# EAGLE design Qwiic GPS-RTK - ublox NEO-M8P (EAGLE 9.1.1)
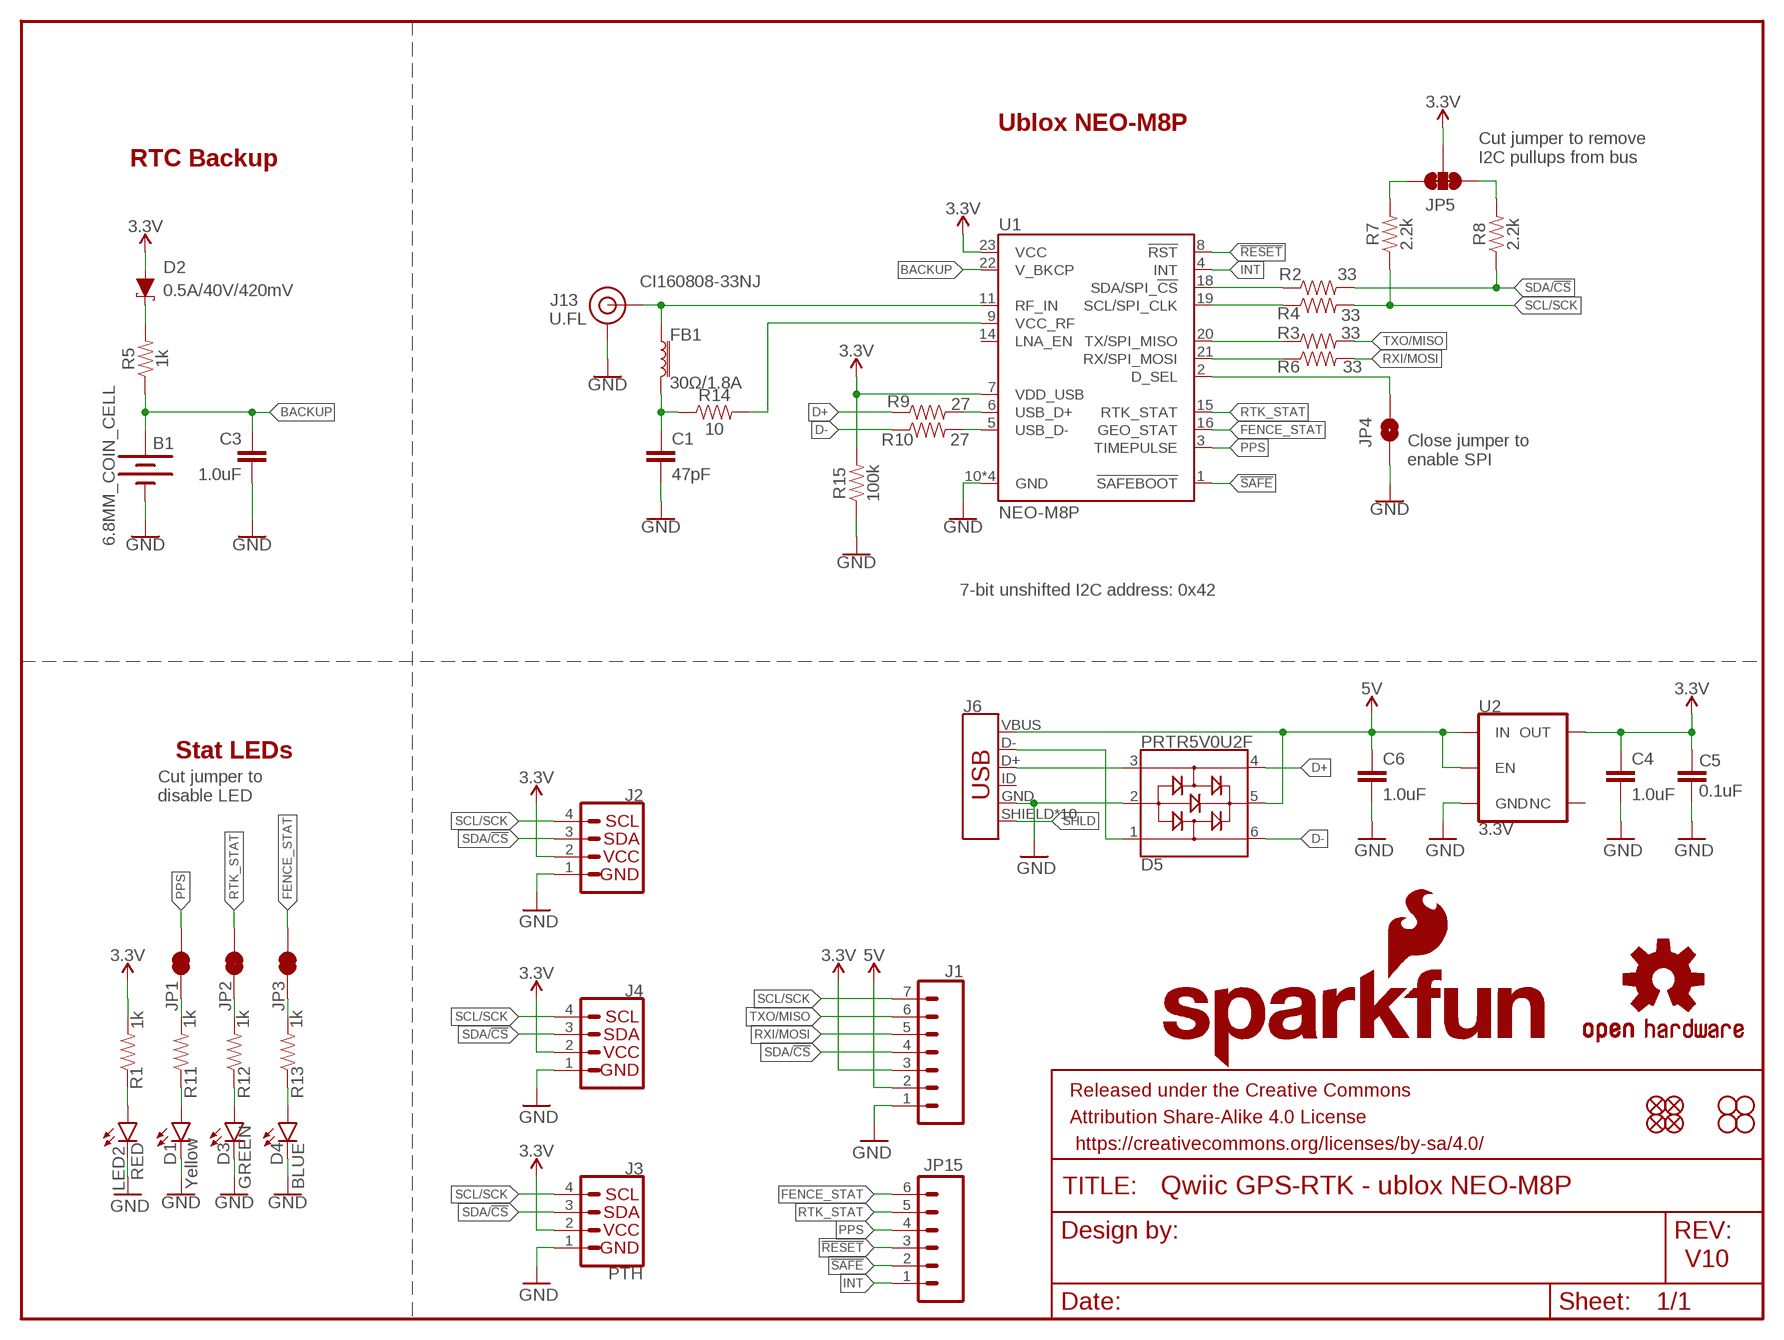
[diagram p0: schematic, sheet 1]

## Parts
B1  6.8MM_COIN_CELL  BATTERY-6.8MM_SMD  [BATTCON-6.8MM]
C1  47pF  47PF-0603-50V-5%  [0603]
C3  1.0uF  1.0UF-0603-16V-10%  [0603]
C4  1.0uF  1.0UF-0603-16V-10%  [0603]
C5  0.1uF  0.1UF-0603-25V-(+80/-20%)  [0603]
C6  1.0uF  1.0UF-0603-16V-10%  [0603]
D1  Yellow  LED-YELLOW0603  [LED-0603]
D2  0.5A/40V/420mV  DIODE-SCHOTTKY-PMEG4005EJ  [SOD-323]
D3  GREEN  LED-GREEN0603  [LED-0603]
D4  BLUE  LED-BLUE0603  [LED-0603]
D5  PRTR5V0U2F  [SOT886]
FB1  30Ω/1.8A  FERRITE_BEAD-0603  [0603]
FRAME1  FRAME-LETTER  [CREATIVE_COMMONS]
J1  CONN_07NO_SILK  [1X07_NO_SILK]
J2  I2C_STANDARDQWIIC  [1X04_1MM_RA]
J3  PTH  I2C_STANDARD_NO_SILK  [1X04_NO_SILK]
J4  I2C_STANDARDQWIIC  [1X04_1MM_RA]
J6  USB_MICRO-B_HALF_PTH_MILL  [USB-MICROB-PTH-MILL]
J13  U.FL  U.FL2PIN  [U.FL]
JP1  JUMPER-SMT_2_NC_TRACE_SILK  [SMT-JUMPER_2_NC_TRACE_SILK]
JP2  JUMPER-SMT_2_NC_TRACE_SILK  [SMT-JUMPER_2_NC_TRACE_SILK]
JP3  JUMPER-SMT_2_NC_TRACE_SILK  [SMT-JUMPER_2_NC_TRACE_SILK]
JP4  JUMPER-SMT_2_NO_SILK  [SMT-JUMPER_2_NO_SILK]
JP5  JUMPER-SMT_3_2-NC_TRACE_SILK  [SMT-JUMPER_3_2-NC_TRACE_SILK]
JP15  M06NO_SILK_FEMALE_PTH  [1X06_NO_SILK]
JP21  FIDUCIALUFIDUCIAL  [MICRO-FIDUCIAL]
JP31  STAND-OFF  [STAND-OFF]
JP41  STAND-OFF  [STAND-OFF]
JP61  FIDUCIALUFIDUCIAL  [MICRO-FIDUCIAL]
JP71  FIDUCIALUFIDUCIAL  [MICRO-FIDUCIAL]
JP81  FIDUCIALUFIDUCIAL  [MICRO-FIDUCIAL]
JP91  STAND-OFF  [STAND-OFF]
JP101  STAND-OFF  [STAND-OFF]
LED2  RED  LED-RED0603  [LED-0603]
LOGO1  OSHW-LOGOMINI  [OSHW-LOGO-MINI]
LOGO2  SFE_LOGO_NAME_FLAME.1_INCH  [SFE_LOGO_NAME_FLAME_.1]
R1  1k  1KOHM-0603-1/10W-1%  [0603]
R2  33  33OHM-0603-1/10W-1%  [0603]
R3  33  33OHM-0603-1/10W-1%  [0603]
R4  33  33OHM-0603-1/10W-1%  [0603]
R5  1k  1KOHM-0603-1/10W-1%  [0603]
R6  33  33OHM-0603-1/10W-1%  [0603]
R7  2.2k  2.2KOHM-0603-1/10W-1%  [0603]
R8  2.2k  2.2KOHM-0603-1/10W-1%  [0603]
R9  27  27OHM-0603-1/10W-1%  [0603]
R10  27  27OHM-0603-1/10W-1%  [0603]
R11  1k  1KOHM-0603-1/10W-1%  [0603]
R12  1k  1KOHM-0603-1/10W-1%  [0603]
R13  1k  1KOHM-0603-1/10W-1%  [0603]
R14  10  10OHM-0603-1/10W-1%  [0603]
R15  100k  100KOHM-0603-1/10W-1%  [0603]
U1  NEO-M8P  NEO-M8PM8P  [NEO-M8P]
U2  3.3V  V_REG_AP2112K-3.3V  [SOT23-5]

## Nets
3.3V [3.3V]: C4.1 C5.2 D2.A J1.3 J2.2 J3.2(VCC) J4.2 JP5.2 R1.2 R15.2 U1.7(VDD_USB) U1.23(VCC) U2.5(OUT)
5V: C6.1 D5.5 J1.2 J6.VBUS U2.1(IN) U2.3(EN)
!RESET: JP15.3 U1.8(!RST)
!SAFE: JP15.2 U1.1(!SAFEBOOT!)
ANT_VCC: C1.1 FB1.2 R14.1
BACKUP: B1.+ C3.1 R5.1 U1.22(V_BKCP)
D+: D5.4 R9.1
D-: D5.6 R10.1
D_SEL: JP4.2 U1.2(D_SEL)
FENCE_STAT: JP3.2 JP15.6 U1.16(GEO_STAT)
GND: B1.- C1.2 C3.2 C4.2 C5.1 C6.2 D1.C D3.C D4.C D5.2 J1.1 J2.1 J3.1(GND) J4.1 J6.GND J13.1(GND) J13.2(GND) JP4.1 LED2.C R15.1 U1.10(GND) U1.12(GND) U1.13(GND) U1.24(GND) U2.2(GND)
GPS_ANT1: FB1.1 J13.FEED(SIGNAL) U1.11(RF_IN)
INT: JP15.1 U1.4(INT)
N$1: D3.A R12.1
N$2: D1.A R11.1
N$3: JP2.1 R12.2
N$4: JP1.1 R11.2
N$5: JP5.1 R8.2
N$6: D2.C R5.2
N$7: D4.A R13.1
N$8: JP5.3 R7.2
N$9: JP3.1 R13.2
N$10: LED2.A R1.1
N$11: R9.2 U1.6(USB_D+)
N$12: R10.2 U1.5(USB_D-)
N$13: R14.2 U1.9(VCC_RF)
PPS: JP1.2 JP15.4 U1.3(TIMEPULSE)
RTK_STAT: JP2.2 JP15.5 U1.15(RTK_STAT)
RXI/MOSI: J1.5 R6.2
RXLV: R6.1 U1.21(RX/SPI_MOSI)
SCL/SCK: J1.7 J2.4 J3.4(SCL) J4.4 R4.2 R7.1
SCL_LV: R4.1 U1.19(SCL/SPI_CLK)
SDA/!CS: J1.4 J2.3 J3.3(SDA) J4.3 R2.2 R8.1
SDA_LV: R2.1 U1.18(SDA/SPI_!CS!)
SHLD: J6.SHIELD J6.SHIELD2(SHIELD) J6.SHIELD3(SHIELD) J6.SHIELD4(SHIELD) J6.SHIELD5(SHIELD) J6.SHIELD6(SHIELD) J6.SHIELD7(SHIELD) J6.SHIELD8(SHIELD) J6.SHIELD9(SHIELD) J6.SHIELD10(SHIELD)
TXLV: R3.1 U1.20(TX/SPI_MISO)
TXO/MISO: J1.6 R3.2
USB_D+: D5.3 J6.D+
USB_D-: D5.1 J6.D-
Unconnected: J6.ID U1.14(LNA_EN) U2.4(NC)

## Notes on the sheet
- Ublox NEO-M8P
- RTC Backup
- Cut jumper to remove 
  I2C pullups from bus
- CI160808-33NJ
- Close jumper to
  enable SPI
- 7-bit unshifted I2C address: 0x42
- Stat LEDs
- Cut jumper to 
  disable LED
- V10

## Library data of the parts
B1 = SparkFun-Batteries:BATTERY: Battery - Single Cell A variety of battery chemistries, sizes, and footprints. Device List: 20MM_PTH - Coin Cell Battery Holder - 20mm (PTH) <https://www.sparkfun.com/products/783> 6.8MM_PTH - Coin Cell Battery Holder - 6.8MM(SMD) <https://www.digikey.com/product-detail/en/seiko-instruments/MS621FE-FL11E/728-1057-ND/1889208?WT.srch=1&gclid=CNOQ5a6LzdQCFZS2wAodXCkE0g> 12MM_SMD - Coin Cell Battery Holder - 12mm (SMD) <https://www.sparkfun.com/products/10592> 12MM_PTH - Coin Cell Battery Holder - 12mm (PTH) <https://www.sparkfun.com/products/7948> 20MM_SMD - 20mm Coin Cell Battery Holder (SMD) (2 legs) Used on the Big Time Watch Kit <https://www.sparkfun.com/products/11734> 20MM_SMD_4LEGS - Coin Cell Battery Holder - 20mm (SMD) <https://www.sparkfun.com/products/11892> 20MM_SMD_4LEGS_OVERPASTE - Coin Cell Battery Holder - 20mm (SMD) <https://www.sparkfun.com/products/11892> (Over-paste on the legs) 24.5MM_PTH - Coin Cell Battery Holder - 24.5mm (PTH) <https://www.sparkfun.com/products/8863> 9V - 9V Battery Holder - PC Mount Used on the SparkFun SparkPunk Sound Kit <https://www.sparkfun.com/products/11177> and SparkFun SparkPunk Sequencer Kit <https://www.sparkfun.com/products/12707> 18650 - Battery Holder - 18650 (PTH) <https://www.sparkfun.com/products/13113> AA - Battery Holder - 1xAA (PTH) <https://www.sparkfun.com/products/7949> AAA - Battery Holder - 1xAAA (PTH) <https://www.sparkfun.com/products/12718> AA_KIT - Battery Holder - 1xAA (PTH) <https://www.sparkfun.com/products/7949> Special kit package - pads only have exposed copper on one side of the board. AAA_KIT - Battery Holder - 1xAAA (PTH) <https://www.sparkfun.com/products/12718> Special kit package - pads only have exposed copper on one side of the board.; PROD_ID: BATT-13734
C1 = SparkFun-Capacitors:47PF: 47pF ceramic capacitors A capacitor is a passive two-terminal electrical component used to store electrical energy temporarily in an electric field.; PROD_ID: CAP-08913
C3 C4 C6 = SparkFun-Capacitors:1.0UF: 1µF ceramic capacitors A capacitor is a passive two-terminal electrical component used to store electrical energy temporarily in an electric field.; PROD_ID: CAP-00868
C5 = SparkFun-Capacitors:0.1UF: 0.1µF ceramic capacitors A capacitor is a passive two-terminal electrical component used to store electrical energy temporarily in an electric field.; PROD_ID: CAP-00810
D1 = SparkFun-LED:LED-YELLOW: Yellow SMD LED Used in manufacturing several products at SparkFun. Packages: 0603 - SMD 0603 package[Product Link] <http://www.kingbrightusa.com/product.asp?catalog_name=LED&product_id=APT1608SYCK> 0603 -SMART - SMART SMD 0603 package (more efficient/more expensive) [Product Link] <http://www.osram-os.com/osram_os/en/products/product-catalog/led-light-emitting-diodes/smartled-0603/ly-l29k/index.jsp> LilyPad - SMD1206 package[Product Datasheet] <https://www.sparkfun.com/datasheets/DevTools/LilyPad/Q150YUS4.pdf> SparkFun Products: Blynk Board <https://www.sparkfun.com/products/13794> IOIO-OTG <https://www.sparkfun.com/products/13613> XBee Explorer Serial <https://www.sparkfun.com/products/13225>; PROD_ID: DIO-09003
D2 = SparkFun-DiscreteSemi:DIODE-SCHOTTKY: Schottky diode A Schottky diode is a semiconductor diode which has a low forward voltage drop and a very fast switching action.; PROD_ID: DIO-10955
D3 = SparkFun-LED:LED-GREEN: Green SMD LED Used in manufacturing of various products at SparkFun Packages: 0603 - SMD 0603 package [Product Link] <http://www.futureelectronics.com/en/technologies/semiconductors/optoelectronics/leds/Pages/9894312-LTST-C190GKT.aspx?CrossPart=HSMG-C190&IM=0> LilyPad 1206 - SMD1206 LilyPad package [Product Link] <http://www.futureelectronics.com/en/Technologies/Product.aspx?ProductID=IN150NGHARVATEKCORPORATION2049943&IM=0> 1206 - SMD1206 package [Product Link] <http://www.futureelectronics.com/en/technologies/semiconductors/optoelectronics/leds/Pages/8315665-LTST-C150KGKT.aspx?IM=0> 1206 Bottom Mount -SMD 1206 Bottom Mount [Product Link] <http://www.digikey.com/product-detail/en/lite-on-inc/LTST-C230KGKT/160-1456-1-ND/386854> SparkFun Products: Pro Mini 328 -5V <https://www.sparkfun.com/products/821> RedBoard <https://www.sparkfun.com/products/12757> MP3 Trigger <https://www.sparkfun.com/products/13720> Makey Makey <https://www.sparkfun.com/products/11076>; PROD_ID: DIO-00821
D4 = SparkFun-LED:LED-BLUE: Blue SMD LED Used in manufacturing of various products at SparkFun Packages: 0603 - SMD 0603 package [Product Link] <http://www.digikey.com/product-detail/en/SMLE12BC7TT86/511-1589-2-ND/1641808> 1206 - SMD1206 package [Product Link] <http://www.digikey.com/product-detail/en/lite-on-inc/LTST-C150TBKT/160-1643-1-ND/573584> SparkFun Products: ESP8266 Thing-Dev Board <https://www.sparkfun.com/products/13711> RedBoard <https://www.sparkfun.com/products/12757>; PROD_ID: DIO-08575
D5 = funbit:PRTR5V0U2
FB1 = SparkFun-Coils:FERRITE_BEAD: Ferrite Bead (blocks, cores, rings, chokes, etc.) Inductor with layers of ferrite used to suppress high frequencies. Often used to isolate high frequency noise. SparkFun Products: IOIO-OTG - V2.2 <https://www.sparkfun.com/products/13613> SparkFun SAMD21 Mini Breakout <https://www.sparkfun.com/products/13664> SparkFun 6 Degrees of Freedom Breakout - LSM6DS3 <https://www.sparkfun.com/products/13339> SparkFun SAMD21 Dev Breakout <https://www.sparkfun.com/products/13672>; PROD_ID: NDUC-13805
FRAME1 = SparkFun-Aesthetics:FRAME-LETTER: Schematic Frame - Letter Standard 8.5x11 US Letter frame
J1 = SparkFun-Connectors:CONN_07: Multi connection point. Often used as Generic Header-pin footprint for 0.1 inch spaced/style header connections On any of the 0.1 inch spaced packages, you can populate with these: Break Away Headers - Straight <https://www.sparkfun.com/products/116> (PRT-00116) Break Away Male Headers - Right Angle <https://www.sparkfun.com/products/553> (PRT-00553) Female Headers <https://www.sparkfun.com/products/115> (PRT-00115) Break Away Headers - Machine Pin <https://www.sparkfun.com/products/117> (PRT-00117) Break Away Female Headers - Swiss Machine Pin <https://www.sparkfun.com/products/743> (PRT-00743) For SCREWTERMINALS and SPRING TERMINALS visit here: Screw Terimnals on SparkFun.com <https://www.sparkfun.com/search/results?term=Screw+Terminals> (5mm/3.5mm/2.54mm spacing) This device is also useful as a general connection point to wire up your design to another part of your project. Our various solder wires solder well into these plated through hole pads. Hook-Up Wire - Assortment (Stranded, 22 AWG) <https://www.sparkfun.com/products/11375> (PRT-11375) Hook-Up Wire - Assortment (Solid Core, 22 AWG) <https://www.sparkfun.com/products/11367> (PRT-11367) View the entire wire category on our website here <https://www.sparkfun.com/categories/141> Special notes: Molex polarized connector foot print use with SKU : PRT-08231 with associated crimp pins and housings. 1MM SMD Version SKU: PRT-10208 NOTES ON THE VARIANTS LOCK and LOCK_LONGPADS... This footprint was designed to help hold the alignment of a through-hole component (i.e. 6-pin header) while soldering it into place. You may notice that each hole has been shifted either up or down by 0.005 of an inch from it's more standard position (which is a perfectly straight line). This slight alteration caused the pins (the squares in the middle) to touch the edges of the holes. Because they are alternating, it causes a "brace" to hold the component in place. 0.005 has proven to be the perfect amount of "off-center" position when using our standard breakaway headers. Although looks a little odd when you look at the bare footprint, once you have a header in there, the alteration is very hard to notice. Also,if you push a header all the way into place, it is covered up entirely on the bottom side.
J2 J4 = SparkFun-Connectors:I2C_STANDARD: SparkFun I2C Standard Pinout Header SparkFun has standardized on a pinout for all I2C based sensor breakouts. This pinout allows I2C boards to be plugged directly into the headers on Arduino Uno compatible boards, and to be daisy chained easily. Example SparkFun Products: SparkFun Atmospheric Sensor Breakout - BME280 <https://www.sparkfun.com/products/13676> SparkFun Altitude/Pressure Sensor Breakout - MPL3115A2 <https://www.sparkfun.com/products/11084> SparkFun TOF Range Finder Sensor - VL6180 <https://www.sparkfun.com/products/12785>; PROD_ID: CONN-13694; VALUE: Qwiic Right Angle
J3 = SparkX:I2C_STANDARD: SparkFun I2C Standard Pinout Header SparkFun has standardized on a pinout for all I2C based sensor breakouts. This pinout allows I2C boards to be plugged directly into the headers on Arduino Uno compatible boards, and to be daisy chained easily. Example SparkFun Products: SparkFun Atmospheric Sensor Breakout - BME280 <https://www.sparkfun.com/products/13676> SparkFun Altitude/Pressure Sensor Breakout - MPL3115A2 <https://www.sparkfun.com/products/11084> SparkFun TOF Range Finder Sensor - VL6180 <https://www.sparkfun.com/products/12785>
J6 = SparkFun-Connectors:USB_MICRO-B: USB Type Micro-B Connector Male/female and PTH/SMT variants SparkFun Products: SparkFun microB USB Breakout <https://www.sparkfun.com/products/12035> SparkFun USB microB Plug Breakout <https://www.sparkfun.com/products/10031> SparkFun ESP8266 Thing <https://www.sparkfun.com/products/13231>; PROD_ID: CONN-13711
J13 = SparkFun-Connectors:U.FL2PIN: SMD Antenna Connector - U.FL 2mm height, 3.0mm x 3.0mm receptacle size. SparkFun Products: SparkFun WiFi Shield - ESP8266 <https://www.sparkfun.com/products/13287> SparkFun ESP8266 Thing <https://www.sparkfun.com/products/13231> SparkFun MiniGen - Pro Mini Signal Generator Shield <https://www.sparkfun.com/products/11420>; PROD_ID: CONN-09193; SF_ID: WRL-09144
JP1-JP3 = SparkFun-Jumpers:JUMPER-SMT_2_NC_TRACE: Normally closed trace jumper This jumper has a trace between two pads so it's normally closed (NC). Use a razor knife to open the connection. For best results follow the IPC guidelines for cutting traces: Cutout at least 0.063 mm (0.005 in). Remove all loose material to clean up the cut area. Seal the cut with an approved epoxy. Reapply solder to reclose the connection.
JP4 = SparkFun-Jumpers:JUMPER-SMT_2_NO: Normally open jumper This jumper has two pads in close proximity to each other. Apply solder to close the connection. Round pads are easier to solder for beginners, but are a lot larger. SparkFun Product that uses the round pads: SparkFun EL Sequencer <https://www.sparkfun.com/products/12781>
JP5 = SparkFun-Jumpers:JUMPER-SMT_3_2-NC_TRACE: Normally closed trace jumper (2 of 2 connections) This jumper has a trace between all three pads so they are normally closed (NC). Use a razor knife to open the connection(s). For best results follow the IPC guidelines for cutting traces: Cutout at least 0.063 mm (0.005 in). Remove all loose material to clean up the cut area. Seal the cut with an approved epoxy. Reapply solder to reclose the connection(s).
JP15 = SparkFun-Connectors:M06: Header 6 Standard 6-pin 0.1" header. Use with straight break away headers (SKU : PRT-00116), right angle break away headers (PRT-00553), swiss pins (PRT-00743), machine pins (PRT-00117), and female headers (PRT-00115). Molex polarized connector foot print use with SKU : PRT-08094 with associated crimp pins and housings. NOTES ON THE VARIANTS LOCK and LOCK_LONGPADS... This footprint was designed to help hold the alignment of a through-hole component (i.e. 6-pin header) while soldering it into place. You may notice that each hole has been shifted either up or down by 0.005 of an inch from it's more standard position (which is a perfectly straight line). This slight alteration caused the pins (the squares in the middle) to touch the edges of the holes. Because they are alternating, it causes a "brace" to hold the component in place. 0.005 has proven to be the perfect amount of "off-center" position when using our standard breakaway headers. Although looks a little odd when you look at the bare footprint, once you have a header in there, the alteration is very hard to notice. Also,if you push a header all the way into place, it is covered up entirely on the bottom side. This idea of altering the position of holes to aid alignment will be further integrated into the Sparkfun Library for other footprints. It can help hold any component with 3 or more connection pins.; PROD_ID: CONN-08437
JP21 JP61 JP71 JP81 = SparkFun:FIDUCIAL: Fiducial Alignment Points Various fiducial points for machine vision alignment.
JP31 JP41 JP91 JP101 = SparkFun:STAND-OFF: Stand Off This is the mechanical footprint for a #4 phillips button head screw. Use the keepout ring to avoid running the screw head into surrounding components. SKU : PRT-00447
LED2 = SparkFun-LED:LED-RED: Red SMD LED Used in manufacturing of most products at SparkFun Packages: 0603 - SMD 0603 package [Product Link] <http://docs.avagotech.com/docs/AV02-0551EN> 0603 SMART - SMD 0603 SMART package ( more efficient and expensive)[Product Link] <http://www.osram-os.com/Graphics/XPic2/00077099_0.pdf> 1206 - SMD1206 package [Product Link] <https://www.sparkfun.com/datasheets/DevTools/LilyPad/Q150OVS4.pdff> SparkFun Products: Pro Mini 328 -5V <https://www.sparkfun.com/products/821> RedBoard <https://www.sparkfun.com/products/12757> IOIO-OTG <https://www.sparkfun.com/products/13613>; PROD_ID: DIO-00819
LOGO1 = SparkFun-Aesthetics:OSHW-LOGO: Open-Source Hardware (OSHW) Logo This logo indicates the piece of hardware it is found on incorporates a OSHW license and/or adheres to the definition of open source hardware found here: http://freedomdefined.org/OSHW
LOGO2 = SparkFun-Aesthetics:SFE_LOGO_NAME_FLAME: SparkFun Font Logo w/ Flame This is the SparkFun full logo. The logo on the schematic will always be the same size; the package variant is the height of the flame part of the logo. Default layer for the logo on the board is tSilk.
R1 R5 R11-R13 = SparkFun-Resistors:1KOHM: 1kΩ resistor A resistor is a passive two-terminal electrical component that implements electrical resistance as a circuit element. Resistors act to reduce current flow, and, at the same time, act to lower voltage levels within circuits. - Wikipedia; PROD_ID: RES-07856
R2-R4 R6 = SparkFun-Resistors:33OHM: 33Ω resistor A resistor is a passive two-terminal electrical component that implements electrical resistance as a circuit element. Resistors act to reduce current flow, and, at the same time, act to lower voltage levels within circuits. - Wikipedia; PROD_ID: RES-08270
R7 R8 = SparkFun-Resistors:2.2KOHM: 2.2kΩ resistor A resistor is a passive two-terminal electrical component that implements electrical resistance as a circuit element. Resistors act to reduce current flow, and, at the same time, act to lower voltage levels within circuits. - Wikipedia; PROD_ID: RES-08272
R9 R10 = SparkFun-Resistors:27OHM: 27Ω resistor A resistor is a passive two-terminal electrical component that implements electrical resistance as a circuit element. Resistors act to reduce current flow, and, at the same time, act to lower voltage levels within circuits. - Wikipedia; PROD_ID: RES-09334
R14 = SparkFun-Resistors:10OHM: 10Ω resistor A resistor is a passive two-terminal electrical component that implements electrical resistance as a circuit element. Resistors act to reduce current flow, and, at the same time, act to lower voltage levels within circuits. - Wikipedia; PROD_ID: RES-12581
R15 = SparkFun-Resistors:100KOHM: 100kΩ resistor A resistor is a passive two-terminal electrical component that implements electrical resistance as a circuit element. Resistors act to reduce current flow, and, at the same time, act to lower voltage levels within circuits. - Wikipedia; PROD_ID: RES-07828
U1 = NEO-M8P:NEO-M8P; PROD_ID: IC-14069
U2 = SparkFun-IC-Power:V_REG_AP2112: AP2112 - 600mA CMOS LDO Regulator w/ Enable The AP2112 is CMOS process low dropout linear regulator with enable function, the regulator delivers a guaranteed 600mA (min.) continuous load current. Features Output Voltage Accuracy: ±1.5% Output Current: 600mA (Min.) Foldback Short Current Protection: 50mA Enable Function to Turn ON/OFF VOUT Low Dropout Voltage (3.3V): 250mV (Typ.) @IOUT=600mA Excellent Load Regulation: 0.2%/A (Typ.) Excellent Line Regulation: 0.02%/V (Typ.) Low Quiescent Current: 55μA (Typ.) Low Standby Current: 0.01μA (Typ.) Low Output Noise: 50μVRMS PSRR: 100Hz -65dB, 1kHz -65dB OTSD Protection Stable with 1.0μF Flexible Cap: Ceramic, Tantalum and Aluminum Electrolytic Operation Temperature Range: -40°C to 85°C ESD: MM 400V, HBM 4000V; PROD_ID: VREG-12457

## Net classes
1 vcc: width 0.152 mm
2 3.3V: width 0.508 mm

## Board
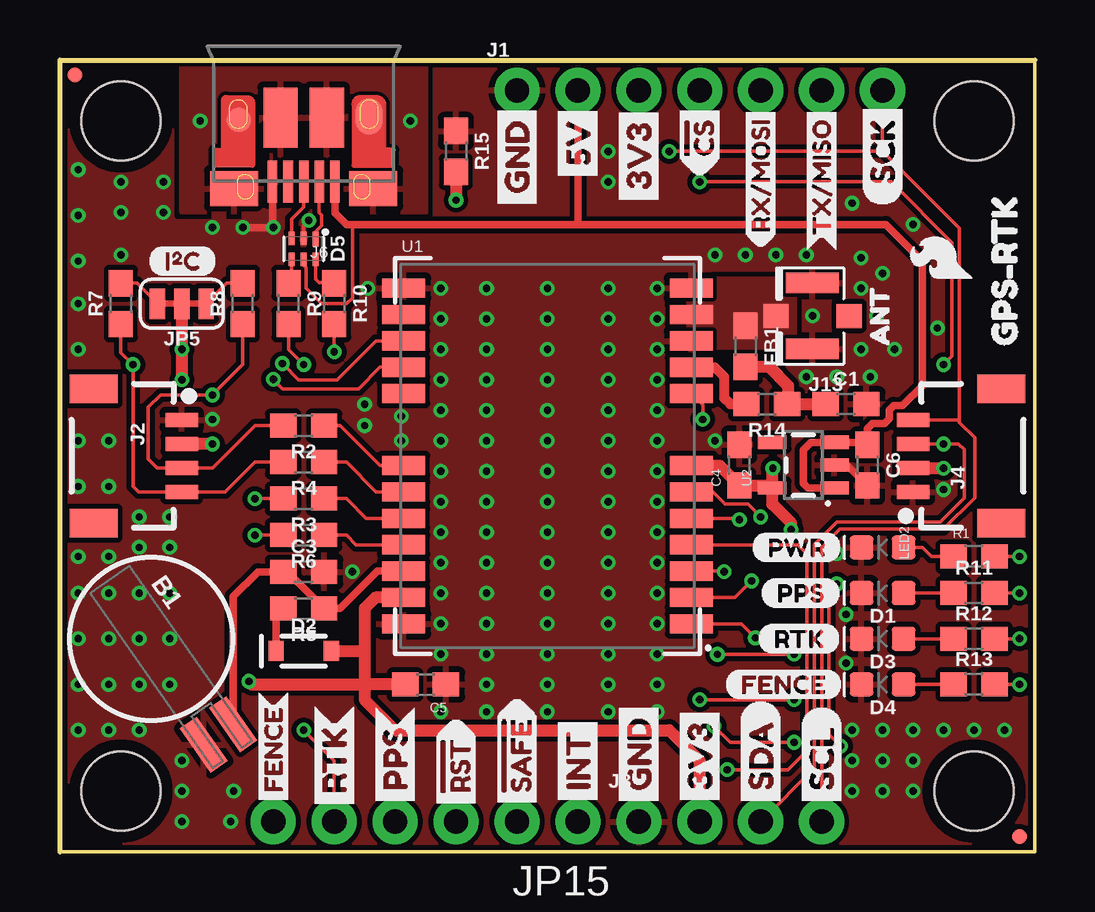
[diagram p1: board, top side]
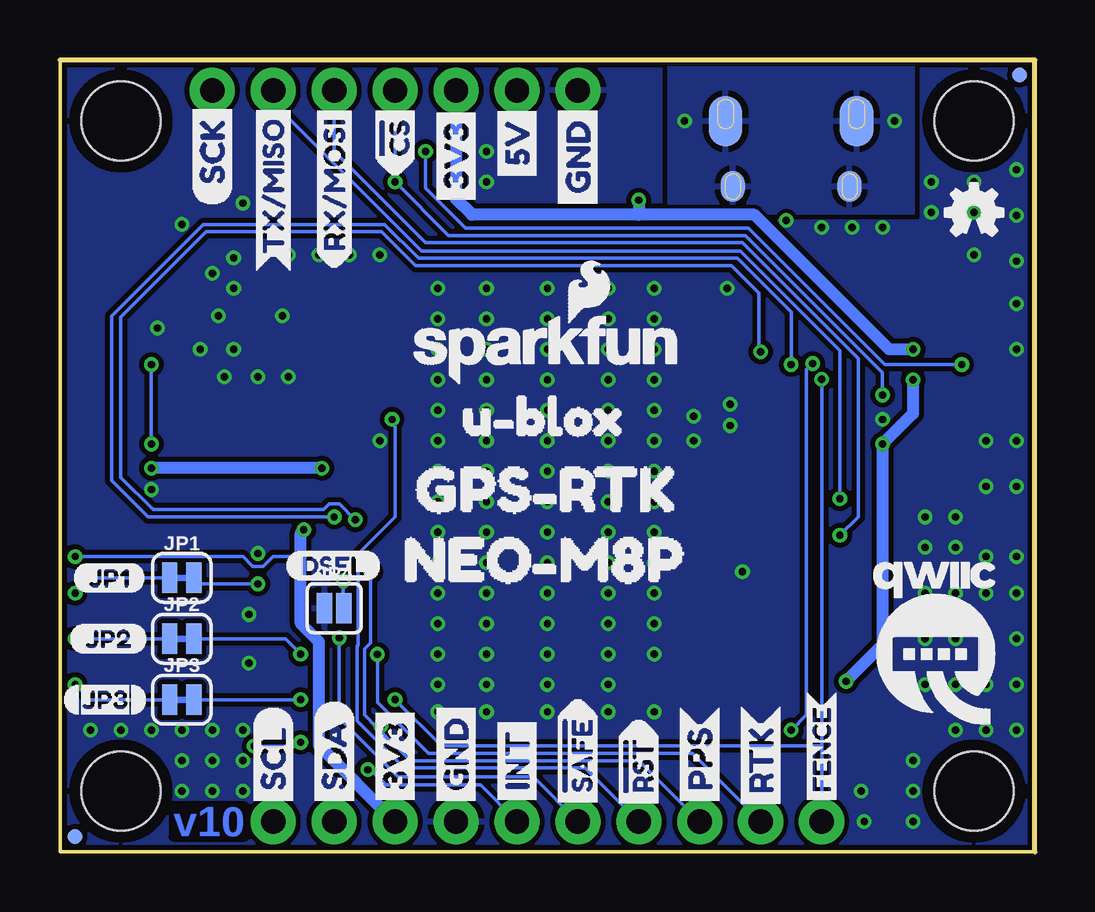
[diagram p2: board, bottom side, seen from below]

Size 40.64 x 33.02 mm. Coordinates in mm from the lower left corner, seen from the top.
Outline: 0,0 0,33.02 40.64,33.02 40.64,0 0,0
Copper layers (1*16): Top 0.035mm / dielectric 1.5mm / Bottom 0.035mm
Design rules "SparkFun-2-layer-PCBWay-LIMIT": minimum track width 6mil, minimum drill 0.3mm, track to track 6mil, track to pad 6mil, pad to pad 6mil, via to via 6mil, smd to smd 6mil, copper to edge 6mil, drill to drill 6mil, minimum pad ring 6mil, minimum via ring 6mil, stop-mask expansion 4mil, vias tented up to drill 25mil, thermal gap 10mil

### Footprints (pad centres in the part's own frame; a part is rotated, then mirrored left to right if it is on the bottom)
BATTCON-6.8MM = smd 2.25 x 0.85: + 4.87,0.75; - 4.87,-0.75
0603 = smd 1.1 x 1: 1 -0.85,0; 2 0.85,0
LED-0603 = smd 1 x 1: A -0.877,0; C 0.877,0
SOD-323 = smd 0.63 x 0.83: A 1.15,0; C -1.15,0
SOT886 = smd 0.61 x 0.25: 1 -0.405,0.5 | smd 0.56 x 0.25: 2 -0.43,0; 3 -0.43,-0.5; 4 0.43,-0.5; 5 0.43,0; 6 0.43,0.5
1X07_NO_SILK = drill 1.016 pad 1.88: 1 0,0; 2 2.54,0; 3 5.08,0; 4 7.62,0; 5 10.16,0; 6 12.7,0; 7 15.24,0
1X04_1MM_RA = smd 0.6 x 1.35: 1 -1.5,0; 2 -0.5,0; 3 0.5,0; 4 1.5,0 | smd 1.2 x 2: NC1 2.8,-3.675; NC2 -2.8,-3.675
1X04_NO_SILK = drill 1.016 pad 1.88: 1 0,0; 2 2.54,0; 3 5.08,0; 4 7.62,0
USB-MICROB-PTH-MILL = smd 0.4 x 1.75: D+ 0,0; D- -0.65,0; GND 1.3,0; ID 0.65,0; VBUS -1.3,0 | smd 2 x 1.46: SHIELD -2.9,0.275; SHIELD2 2.9,0.275 | smd 1.425 x 2.5: SHIELD3 -0.963,-2.675; SHIELD4 0.963,-2.675 | smd 1.4 x 2.1 bottom: SHIELD5 -2.731,-2.531; SHIELD7 2.729,-2.531 | smd 1 x 1: SHIELD6 2.7,-2.575 | smd 1.1 x 1.5: SHIELD8 -2.731,-2.731 | smd 1 x 1.3 bottom: SHIELD9 -2.43,0.195; SHIELD10 2.43,0.195
U.FL = smd 2.2 x 0.85: 1 0,1.375; 2 0,-1.375 | smd 1.05 x 1: FEED 1.525,0; NC -1.525,0
SMT-JUMPER_2_NC_TRACE_SILK = smd 0.635 x 1.27: 1 -0.508,0; 2 0.508,0
SMT-JUMPER_2_NO_SILK = smd 0.635 x 1.27: 1 -0.406,0; 2 0.406,0
SMT-JUMPER_3_2-NC_TRACE_SILK = smd 0.635 x 1.27: 1 -1.016,0; 2 0,0; 3 1.016,0
1X06_NO_SILK = drill 1.016 pad 1.88: 1 0,0; 2 2.54,0; 3 5.08,0; 4 7.62,0; 5 10.16,0; 6 12.7,0
MICRO-FIDUCIAL = smd 0.635 x 0.635: 1 0,0
STAND-OFF = hole 3.302: 0,0
NEO-M8P = smd 1.8 x 0.8: 1 6,-7; 2 6,-5.9; 3 6,-4.8; 4 6,-3.7; 5 6,-2.6; 6 6,-1.5; 7 6,-0.4; 8 6,2.6; 9 6,3.7; 10 6,4.8; 11 6,5.9; 12 6,7; 13 -6,7; 14 -6,5.9; 15 -6,4.8; 16 -6,3.7; 17 -6,2.6; 18 -6,-0.4; 19 -6,-1.5; 20 -6,-2.6; 21 -6,-3.7; 22 -6,-4.8; 23 -6,-5.9; 24 -6,-7
SOT23-5 = smd 0.55 x 1.2: 1 -0.95,-1.3; 2 0,-1.3; 3 0.95,-1.3; 4 0.95,1.3; 5 -0.95,1.3

### Placement (x,y rotation side)
B1  3.81,8.89 305 top
C1  32.77,18.67 0 top
C3  10.16,11.68 0 top
C4  28.32,16.13 90 top
C5  15.24,6.99 180 top
C6  33.66,16.13 270 top
D1  34.29,10.79 180 top
D2  10.16,8.38 0 top
D3  34.29,8.89 180 top
D4  34.29,6.99 180 top
D5  10.16,25.15 270 top
FB1  28.57,21.08 270 top
FRAME1  -17.78,-17.78 0 top  (outside the outline)
J1  19.05,31.75 0 top
J2  5.08,16.51 270 top
J3  24.13,1.27 0 top
J4  35.56,16.51 90 top
J6  10.16,27.94 180 top
J13  31.37,22.35 180 top
JP1  35.56,11.43 0 bottom
JP2  35.56,8.89 0 bottom
JP3  35.56,6.35 0 bottom
JP4  29.21,10.16 0 bottom
JP5  5.08,22.86 180 top
JP15  21.59,1.27 180 top
JP21  40.01,0.64 0 top
JP31  2.54,30.48 0 top
JP41  38.1,30.48 0 top
JP61  0.64,32.38 0 top
JP71  40.01,0.64 0 bottom
JP81  0.64,32.38 0 bottom
JP91  2.54,2.54 0 top
JP101  38.1,2.54 0 top
LED2  34.29,12.7 180 top
LOGO1  2.54,26.67 0 bottom
LOGO2  26.29,19.43 0 bottom
R1  38.1,12.32 0 top
R2  10.16,17.78 180 top
R3  10.16,14.73 180 top
R4  10.16,16.26 180 top
R5  10.16,10.16 180 top
R6  10.16,13.21 180 top
R7  2.54,22.86 90 top
R8  7.62,22.86 90 top
R9  9.53,22.86 270 top
R10  11.43,22.86 270 top
R11  38.1,10.79 0 top
R12  38.1,8.89 0 top
R13  38.1,6.99 0 top
R14  29.46,18.67 180 top
R15  16.51,29.21 270 top
U1  20.32,16.51 0 top
U2  30.99,16.13 90 top
U$1  [SDA-[)]  29.21,1.65 90 top
U$3  [SCL-[)]  31.75,1.65 90 top
U$4  [SDA-[)]  29.21,1.65 90 bottom
U$5  [SCL-[)]  31.75,1.65 90 bottom
U$6  [3V3-04]  26.67,1.65 90 top
U$7  [3V3-04]  26.67,1.65 90 bottom
U$8  [GND-04]  24.13,1.65 90 top
U$9  [GND-04]  24.13,1.65 90 bottom
U$10  [I_SUPER2_C-()-03]  3.68,24.64 0 top
U$11  [FENCE2]  27.69,6.99 0 top
U$12  [JP20]  40.26,8.89 0 bottom
U$13  [RTK1]  29.08,8.89 0 top
U$14  [FENCE0]  8.89,1.78 90 top
U$15  [INT8]  21.59,1.65 90 top
U$16  [INT8]  21.59,1.65 90 bottom
U$17  [FENCE0]  8.89,1.78 90 bottom
U$18  [PWR-()-03]  28.83,12.7 0 top
U$19  [5V]  21.59,27.69 90 top
U$20  [5V]  21.59,27.69 90 bottom
U$21  [GPS#RTK0]  39.37,20.19 90 top
U$22  [U#BLOX3]  25.27,18.16 0 bottom
U$23  [CS#-<]]  26.67,27.94 90 top
U$24  [CS#-<]]  26.67,27.94 90 bottom
U$25  [JP10]  40.13,11.43 0 bottom
U$26  [RX#MOSI2]  29.21,25.15 90 top
U$27  [DSEL0]  31.24,11.94 0 bottom
U$28  [RTK1]  11.43,1.52 90 bottom
U$29  [RTK1]  11.43,1.52 90 top
U$30  [QWIIC-LOGO-MEDIUM]  4.19,8.76 0 bottom
U$31  [RX#MOSI3]  29.21,24.26 90 bottom
U$32  [JP32]  40.51,6.35 0 bottom
U$33  [SFE_LOGO_FLAME_.1]  38.35,23.62 90 top
U$34  [TX#MISO0]  31.75,25.02 90 top
U$35  [#RST3]  16.51,1.4 90 top
U$36  [#RST3]  16.51,1.4 90 bottom
U$37  [TX#MISO1]  31.75,24.13 90 bottom
U$38  [SCK-(]-04]  34.29,26.92 90 top
U$39  [#SAFE1]  19.05,1.4 90 top
U$40  [#SAFE1]  19.05,1.4 90 bottom
U$41  [SCK-(]-04]  34.29,26.92 90 bottom
U$43  [PPS5]  13.97,1.65 90 top
U$44  [PPS5]  13.97,1.65 90 bottom
U$52  [PPS0]  29.21,10.79 0 top
U$53  [NEO#M8P3]  27.94,12.19 0 bottom
U$54  [GPS#RTK1]  27.43,15.11 0 bottom
U$55  [ANT0]  34.16,20.45 90 top
U$60  [3V3-04]  24.13,26.67 90 bottom
U$61  [3V3-04]  24.13,26.67 90 top
U$62  [GND-04]  19.05,26.54 90 bottom
U$63  [GND-04]  19.05,26.54 90 top

### Tracks (layer width: path | path; a pad name or v marks a point on that pad's centre or on a via)
3.3V  (via drill 0.3)
  Top 0.152: v5.08,20.95 JP5.2 | R1.2 v40.01,12.32
  Top 0.508: v6.35,17.01 J2.2 | JP5.2 v5.08,19.68 | U1.7 27.49,16.11 C4.1 29.59,15.28 U2.5 | U2.5 29.69,15.97 v29.72,16 | J4.2 v36.83,16 | v30.48,13.44 30.48,13.72 29.69,14.51 U2.5 | J3.2 26.67,3.81 25.4,5.08 13.97,5.08 12.7,6.35 12.7,6.99 | U1.23 13.15,10.61 12.7,10.16 12.7,8.38 | 12.7,8.38 12.7,6.99 | C5.2 12.7,6.99 | v7.87,7.11 8,6.99 12.7,6.99 | D2.A 12.7,8.38 | R15.2 v16.51,27.18
  Bottom 0.152: v40.01,12.32 33.01,12.32 32.61,11.91 32.16,11.91 31.76,12.32 30.61,12.32
  Bottom 0.508: v5.08,20.95 6.07,20.95 11.69,26.57 16.51,26.57 | v5.08,19.68 5.08,18.28 v6.35,17.01 6.35,8.64 v7.87,7.11 | v29.72,16 v36.83,16 | J3.2 29.84,4.45 29.84,8.76 30.61,9.53 30.61,12.32 30.61,13.31 v30.48,13.44 | J1.3 24.13,27.23 23.47,26.57 16.51,26.57 | v16.51,27.18 16.51,26.57
5V
  Top 0.152: D5.5 10.16,24.45 10.25,24.36 10.25,23.51 10.91,22.86 11.95,22.86 12.19,23.1 12.19,26.16
  Top 0.254: 33.62,17.02 C6.1
  Top 0.305: J6.VBUS 11.46,26.64 11.94,26.16 12.19,26.16 21.59,26.16 | 33.62,17.02 33.66,17.06 33.63,17.08 U2.3 31.3,17.08 30.99,16.76 30.99,15.37 31.18,15.18 U2.1 | 21.59,26.16 34.42,26.16 35.94,24.64 35.94,19.43 35.12,18.61 34.76,18.61 34.58,18.44 34.58,18.07 34.37,17.86 33.87,17.86 33.66,17.65 C6.1 | J1.2 21.59,26.16
!RESET  (via drill 0.3)
  Top 0.152: U1.8 26.8,18.63 v26.8,18.03
  Bottom 0.152: JP15.3 18.75,3.5 26.29,3.5 28.25,5.46 28.25,8.59 28.22,8.61 28.22,12.42 26.67,13.97 26.67,17.91 v26.8,18.03
!SAFE  (via drill 0.3)
  Top 0.152: U1.1 28.41,9.51 v28.99,8.93
  Bottom 0.152: JP15.2 20.9,3.12 26.54,3.12 29.01,5.59 29.01,8.91 v28.99,8.93
ANT_VCC
  Top 0.305: R14.1 30.48,18.67 30.35,18.8
  Top 0.508: 30.48,18.67 C1.1 | FB1.2 29.55,20.23 30.35,19.43 30.35,18.8
BACKUP
  Top 0.152: 9.49,11.68 C3.1
  Top 0.305: U1.22 13.23,11.71 11.68,10.16 R5.1 9.49,11.68 | B1.+ 7.22,10.65 8.26,11.68 C3.1
D+
  Top 0.152: D5.4 9.66,23.84 R9.1
D-
  Top 0.152: D5.6 10.66,23.88 10.79,23.75 11.39,23.75 R10.1
D_SEL  (via drill 0.3)
  Top 0.152: U1.2 28.14,10.61 v28.83,11.3
  Bottom 0.152: v28.83,11.3 28.83,10.19 JP4.2
FENCE_STAT  (via drill 0.3)
  Top 0.152: v30.61,6.35 v26.67,6.35 | U1.16 13.35,20.21 12.45,19.3 9.29,19.3 v8.89,19.7
  Bottom 0.152: JP3.2 v30.61,6.35 | v26.67,6.35 24.74,4.42 8.91,4.42 8.89,4.45 | v8.89,19.7 8.89,4.45 | 8.89,4.45 JP15.6
GND  (via drill 0.3)
  Top 0.152: D5.2 10.16,26.13 v10.37,26.34
  Top 0.305: J6.GND 8.86,26.04 v7.62,26.04 | U2.2 32.8,16.13 C6.2
  other vias: 6.35,18.03 32.77,9.91 32.38,12.45 32.77,7.87 33.02,3.81 15.88,9.53 17.78,9.53 7.24,2.54 12.19,11.68 12.83,23.5 36.83,15.11 34.29,24.13 20.32,9.53 22.86,9.53 24.89,9.53 15.88,10.79 17.78,10.79 20.32,10.79 22.86,10.79 24.89,10.79 15.88,12.06 17.78,12.06 20.32,12.06 22.86,12.06 24.89,12.06 15.88,13.34 17.78,13.34 20.32,13.34 22.86,13.34 24.89,13.34 15.88,14.61 17.78,14.61 20.32,14.61 22.86,14.61 24.89,14.61 15.88,15.88 17.78,15.88 20.32,15.88 22.86,15.88 24.89,15.88 15.88,17.14 17.78,17.14 20.32,17.14 22.86,17.14 24.89,17.14 15.88,18.41 17.78,18.41 20.32,18.41 22.86,18.41 24.89,18.41 15.88,19.68 17.78,19.68 20.32,19.68 22.86,19.68 24.89,19.68 15.88,20.95 17.78,20.95 20.32,20.95 22.86,20.95 24.89,20.95 15.88,22.23 17.78,22.23 20.32,22.23 22.86,22.23 24.89,22.23 15.88,23.5 17.78,23.5 20.32,23.5 22.86,23.5 24.89,23.5 31.11,19.81 33.4,20.95 33.4,23.5 36.58,21.84 33.02,27.05 35.56,26.16 22.86,27.94 22.86,29.21 31.37,22.35 27.3,17.14 33.02,2.54 35.56,2.54 35.56,3.81 38.1,5.08 7.11,1.27 5.08,1.27 5.08,2.54 0.76,24.64 0.76,26.54 0.76,28.45 2.54,27.94 0.76,15.24 0.76,17.14 0.76,20.95 0.76,22.86 0.76,5.08 0.76,6.99 0.76,8.89 0.76,10.79 0.76,12.32 2.03,5.08 2.03,6.99 2.03,8.89 2.03,10.79 2.03,12.32 3.3,5.08 3.3,6.99 3.3,8.89 3.3,10.79 3.3,12.7 5.08,3.81 4.57,6.99 4.57,8.89 4.57,10.79 4.57,12.7 15.88,8.26 17.78,8.26 20.32,8.26 22.86,8.26 24.89,8.26 17.78,6.99 20.32,6.99 22.86,6.99 24.89,6.99 15.88,5.84 17.78,5.84 20.32,5.84 22.86,5.84 24.89,5.84 2.54,24.89 2.54,26.67 4.32,26.67 4.32,27.94 8.89,26.04 6.35,26.04 14.22,17.14 14.22,18.16 12.7,17.78 12.7,18.67 34.29,2.54 34.29,3.81 33.02,5.08 34.29,5.08 35.56,5.08 36.83,5.08 39.37,5.08 3.3,13.97 4.57,13.97 2.03,15.24 2.03,17.14 32.38,19.81 33.78,19.81 34.04,22.35 33.4,24.77 34.8,20.95 29.84,24.89 31.11,24.89 28.57,24.89 27.3,24.89
  pour Top (isolate 0.203, rank 4): 0,33.02 40.64,33.02 40.64,0 0,0
  pour Bottom (isolate 0.203, rank 4): 0,33.02 40.64,33.02 40.64,0 0,0
GPS_ANT1
  pour Top (isolate 0.152, no thermals): 26.34,23.75 26.34,21.2 30.48,21.2 30.48,23.75
INT  (via drill 0.3)
  Top 0.152: U1.4 30.75,12.81 31.14,12.42 31.14,4.22 30.35,3.43 v27.81,3.43
  Bottom 0.152: JP15.1 23.11,2.79 27.05,2.79 27.69,3.43 v27.81,3.43
N$1
  Top 0.152: D3.A R12.1
N$2
  Top 0.152: D1.A R11.1
N$3  (via drill 0.3)
  Top 0.152: R12.2 v40.01,8.89
  Bottom 0.152: v40.01,8.89 JP2.1
N$4  (via drill 0.3)
  Top 0.152: v40.01,10.79 R11.2
  Bottom 0.152: JP1.1 39.37,11.43 v40.01,10.79
N$5
  Top 0.152: JP5.1 6.95,23.71 R8.2
N$6
  Top 0.152: 9.01,9.86 R5.2
  Top 0.305: D2.C 9.01,9.86
N$7
  Top 0.152: D4.A R13.1
N$8
  Top 0.152: JP5.3 3.21,23.71 R7.2
N$9  (via drill 0.3)
  Top 0.152: R13.2 v40.01,6.99
  Bottom 0.152: v40.01,6.99 39.37,6.35 JP3.1
N$10
  Top 0.152: R1.1 36.32,12.32 35.94,12.7 LED2.A
N$11  (via drill 0.3)
  Top 0.152: R9.2 9.53,20.95 v10.16,20.32 | v29.21,13.97 28.68,14.5 27.73,14.5 27.22,15.01 U1.6
  Bottom 0.152: v29.21,13.97 36.96,13.97 38.48,15.49 38.48,22.35 34.67,26.16 27.1,26.16 25.69,24.75 12.41,24.75 10.16,22.51 v10.16,20.32
N$12  (via drill 0.3)
  Top 0.152: R10.2 v11.43,20.85 | U1.5 28.26,13.91 v28.32,13.85
  Bottom 0.152: v11.43,20.85 11.51,20.93 11.51,23.29 12.66,24.45 25.82,24.45 27.23,25.86 34.55,25.86 38.1,22.3 38.1,15.62 36.75,14.28 29.66,14.28 29.43,14.5 28.99,14.5 28.34,13.85 v28.32,13.85
N$13
  Top 0.406: U1.9 27.29,20.21 27.69,19.81 27.69,18.92 27.94,18.67 R14.2
PPS  (via drill 0.3)
  Top 0.152: U1.3 27.66,11.71 v27.69,11.68 | v32.38,11.18 32.05,10.85 32.05,4.9 v32.55,4.41 | v30.61,4.57 27.94,4.57 v27.27,5.24
  Bottom 0.152: JP15.4 16.51,3.81 26.04,3.81 27.43,5.21 | 27.43,5.21 27.94,5.71 27.94,8.46 27.69,8.71 v27.69,11.68 | v32.38,11.18 34.8,11.18 JP1.2 | v32.55,4.41 30.77,4.41 v30.61,4.57 | v27.27,5.24 27.3,5.21 27.43,5.21
RTK_STAT  (via drill 0.3)
  Top 0.152: v30.61,8.26 30.61,8.24 v27.41,8.24 | U1.15 13.18,21.31 11.56,19.68 9.95,19.68 v9.27,20.36 | v10.16,5.08 11.43,3.81 JP15.5
  Bottom 0.152: v27.41,8.24 27.41,6.25 25.27,4.12 14.28,4.12 JP15.5 | v10.16,5.08 9.53,5.71 9.53,20.11 v9.27,20.36 | JP2.2 31.24,8.89 v30.61,8.26
RXI/MOSI  (via drill 0.3)
  Top 0.152: R6.2 v8.13,13.21
  Bottom 0.152: v8.13,13.21 7.37,13.97 7.37,20.57 12.19,25.4 25.4,25.4 29.21,29.21 J1.5
RXLV
  Top 0.152: U1.21 12.34,12.81 11.94,13.21 R6.1
SCL/SCK  (via drill 0.3)
  Top 0.152: R4.2 8.13,16.26 6.88,15.01 J2.4 3.28,15.01 3.05,15.24 v3.05,20.32 2.54,20.83 R7.1 | J3.4 31.75,12.7 32.51,13.46 36.83,13.46 38.13,14.76 38.13,17.27 37.49,17.91 37.49,18.03 | 37.49,18.03 37.49,26.01 34.29,29.21 | v25.4,29.21 34.29,29.21 | 37.49,18.03 37.47,18.01 J4.4 | J1.7 34.29,29.21
  Bottom 0.152: v3.05,20.32 6.25,20.32 11.94,26.01 23.72,26.01 25.4,27.69 v25.4,29.21
SCL_LV
  Top 0.152: U1.19 13.18,15.01 11.94,16.26 R4.1
SDA/!CS  (via drill 0.3)
  Top 0.152: R2.2 8.13,17.78 6.36,16.01 J2.3 4.06,16.01 3.68,16.38 3.68,18.54 4.19,19.05 v6.35,19.05 7.62,20.32 R8.1 | J3.3 31.45,3.5 31.45,12.83 32.39,13.77 36.7,13.77 37.69,14.76 37.69,16.77 37.46,17.01 v36.83,17.01 J4.3 | v26.67,27.94 34.65,27.94 37.19,25.4 37.19,20.68 v36.83,20.32
  Bottom 0.152: v6.35,19.05 6.35,19.99 12.07,25.7 24.43,25.7 v26.67,27.94 J1.4 | v36.83,17.01 v36.83,20.32
SDA_LV
  Top 0.152: U1.18 13.35,16.11 11.68,17.78 R2.1
SHLD  (via drill 0.3)
  other vias: 14.61,30.48 5.84,30.48
  pour Bottom: 15.24,33.02 15.24,26.67 5.08,26.67 5.08,33.02
  pour Top: 15.24,33.02 15.24,26.67 5.08,26.67 5.08,33.02
TXLV
  Top 0.152: U1.20 12.76,13.91 11.94,14.73 R3.1
TXO/MISO  (via drill 0.3)
  Top 0.152: R3.2 v8.13,14.73
  Bottom 0.152: v8.13,14.73 8.13,20.91 12.28,25.06 25.57,25.06 31.75,31.24 J1.6
USB_D+
  Top 0.152: D5.3 9.66,26.38 10.16,26.88 J6.D+
USB_D-
  Top 0.152: D5.1 10.66,25.87 10.9,26.11 10.9,26.56 10.81,26.65 J6.D-

### Text on the board
Bottom: v10
Measures: Measurements in inches